# Altium schematic sheet LED_DRIVER.SchDoc
size A3; SheetNumber: 12; SheetTotal: 16
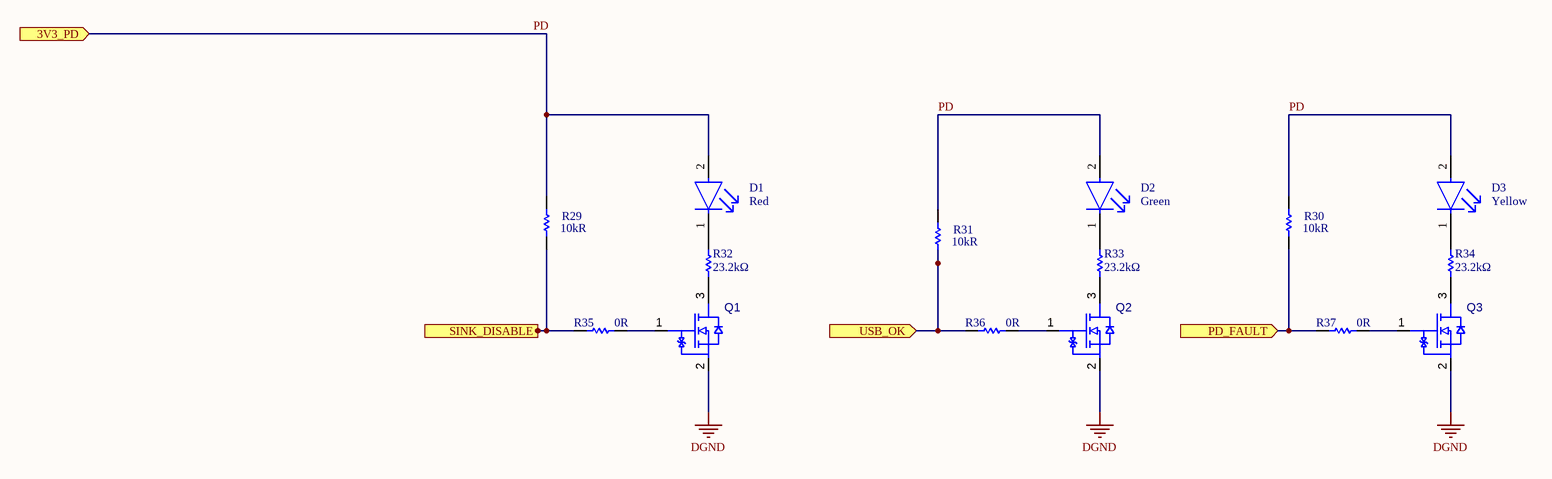
[diagram p0: LED_DRIVER.SchDoc]

## Parts
D1  value Red  [FP-VLMO1500-GS08-MFG]  (hidden comment: VLMS1500-GS08)
D2  value Green  [FP-VLMO1500-GS08-MFG]  (hidden comment: VLMG1500-GS08)
D3  value Yellow  [FP-VLMO1500-GS08-MFG]  (hidden comment: VLMY1500-GS08)
Q1  RUM002N05T2L  [ROHM-SOT723-3_V]  (value not drawn)
Q2  RUM002N05T2L  [ROHM-SOT723-3_V]  (value not drawn)
Q3  RUM002N05T2L  [ROHM-SOT723-3_V]  (value not drawn)
R29  value 10kR  [RESC1005X40X25LL10T10]  (hidden comment: RK73H1ETTP1002F)
R30  value 10kR  [RESC1005X40X25LL10T10]  (hidden comment: RK73H1ETTP1002F)
R31  value 10kR  [RESC1005X40X25LL10T10]  (hidden comment: RK73H1ETTP1002F)
R32  value 23.2kΩ  [RESC1005X40X25LL10T10]  (hidden comment: RK73H1ETTP2322F)
R33  value 23.2kΩ  [RESC1005X40X25LL10T10]  (hidden comment: RK73H1ETTP2322F)
R34  value 23.2kΩ  [RESC1005X40X25LL10T10]  (hidden comment: RK73H1ETTP2322F)
R35  value 0R  [FP-RK73Z1E-IPC_B]  (hidden comment: RK73Z1ETTP)
R36  value 0R  [FP-RK73Z1E-IPC_B]  (hidden comment: RK73Z1ETTP)
R37  value 0R  [FP-RK73Z1E-IPC_B]  (hidden comment: RK73Z1ETTP)

## Ports
3V3_PD (in), PD_FAULT (in), SINK_DISABLE (in), USB_OK (in)

## Nets
DGND: Q1.2(S) Q2.2(S) Q3.2(S)
PD: D1.2(A) D2.2(A) D3.2(A) R29.1 R30.1 R31.1 ; port 3V3_PD
PD_FAULT: R30.2 R37.1 ; port PD_FAULT
SINK_DISABLE: R29.2 R35.1 ; port SINK_DISABLE
USB_OK: R31.2 R36.1 ; port USB_OK
NetD1_1: D1.1(C) R32.2
NetD2_1: D2.1(C) R33.2
NetD3_1: D3.1(C) R34.2
NetQ1_1: Q1.1(G) R35.2
NetQ1_3: Q1.3(D) R32.1
NetQ2_1: Q2.1(G) R36.2
NetQ2_3: Q2.3(D) R33.1
NetQ3_1: Q3.1(G) R37.2
NetQ3_3: Q3.3(D) R34.1

## Library data of the parts
D1 = CMP-00030-24098164-1: RED 0402 VLMx1500; Luminous Intensity: 90mcd; Dominant Wavelength: 605nm; Forward Voltage: 2V; Test Current: 20mA; Lens Style: Rectangular, Square; Reverse Voltage: 5V; Power Rating: 75mW; Illumination Color: Orange; Viewing Angle: 130°; Number of LEDs: 1; NexarPartId: 24098164; Ambient Temperature Range High: 85°C; Wavelength: 605nm; Schedule B: 8541402000, 8541402000; Number of Pins: 2; Length: 1mm; Width: 500µm; Case/Package: 0402; RoHS: Compliant; Packaging: Cut Tape; Radiation Hardening: No; Case Code (Imperial): 0402; Lead Free: Lead Free; Case Code (Metric): 1005; Forward Current: 20mA; Color: Orange; Min Operating Temperature: -30°C; Height: 350µm; Max Operating Temperature: 85°C; Mount: Surface Mount; Power Dissipation: 75mW
D2 = CMP-00030-24098164-1: GREEN 0402 VLMx1500; Luminous Intensity: 90mcd; Dominant Wavelength: 605nm; Forward Voltage: 2V; Test Current: 20mA; Lens Style: Rectangular, Square; Reverse Voltage: 5V; Power Rating: 75mW; Illumination Color: Orange; Viewing Angle: 130°; Number of LEDs: 1; NexarPartId: 24098164; Ambient Temperature Range High: 85°C; Wavelength: 605nm; Schedule B: 8541402000, 8541402000; Number of Pins: 2; Length: 1mm; Width: 500µm; Case/Package: 0402; RoHS: Compliant; Packaging: Cut Tape; Radiation Hardening: No; Case Code (Imperial): 0402; Lead Free: Lead Free; Case Code (Metric): 1005; Forward Current: 20mA; Color: Orange; Min Operating Temperature: -30°C; Height: 350µm; Max Operating Temperature: 85°C; Mount: Surface Mount; Power Dissipation: 75mW
D3 = CMP-00030-24098164-1: YELLOW 0402 VLMx1500; Luminous Intensity: 90mcd; Dominant Wavelength: 605nm; Forward Voltage: 2V; Test Current: 20mA; Lens Style: Rectangular, Square; Reverse Voltage: 5V; Power Rating: 75mW; Illumination Color: Orange; Viewing Angle: 130°; Number of LEDs: 1; NexarPartId: 24098164; Ambient Temperature Range High: 85°C; Wavelength: 605nm; Schedule B: 8541402000, 8541402000; Number of Pins: 2; Length: 1mm; Width: 500µm; Case/Package: 0402; RoHS: Compliant; Packaging: Cut Tape; Radiation Hardening: No; Case Code (Imperial): 0402; Lead Free: Lead Free; Case Code (Metric): 1005; Forward Current: 20mA; Color: Orange; Min Operating Temperature: -30°C; Height: 350µm; Max Operating Temperature: 85°C; Mount: Surface Mount; Power Dissipation: 75mW
Q1-Q3 = CMP-013-00026-2: Nch Small Signal MOSFET, 50 V, 200 mA, 3-Pin SOT723, RoHS, Tape and Reel; Vgs(th) (Max) @ Id: 1V@1mA; Pins: 3
R29-R31 = CMP-x00150-1: Fixed Resistor, Metal Glaze/thick Film, 0.1W, 10000ohm, 75V, 1% +/-Tol, 100ppm/Cel, Surface Mount, 0402
R32-R34 = CMP-009-00229-1: Fixed Resistor, Metal Glaze/thick Film, 0.1W, 23200ohm, 75V, 1% +/-Tol, 100ppm/Cel, Surface Mount, 0402; Vendor: TTI; Rating: 1/10W; Category: Resistor; Package: 0402; Price: 0.00295
R35-R37 = CMP-x00147-1: Metal Glaze/thick Film, 0ohm, Surface Mount, 0402